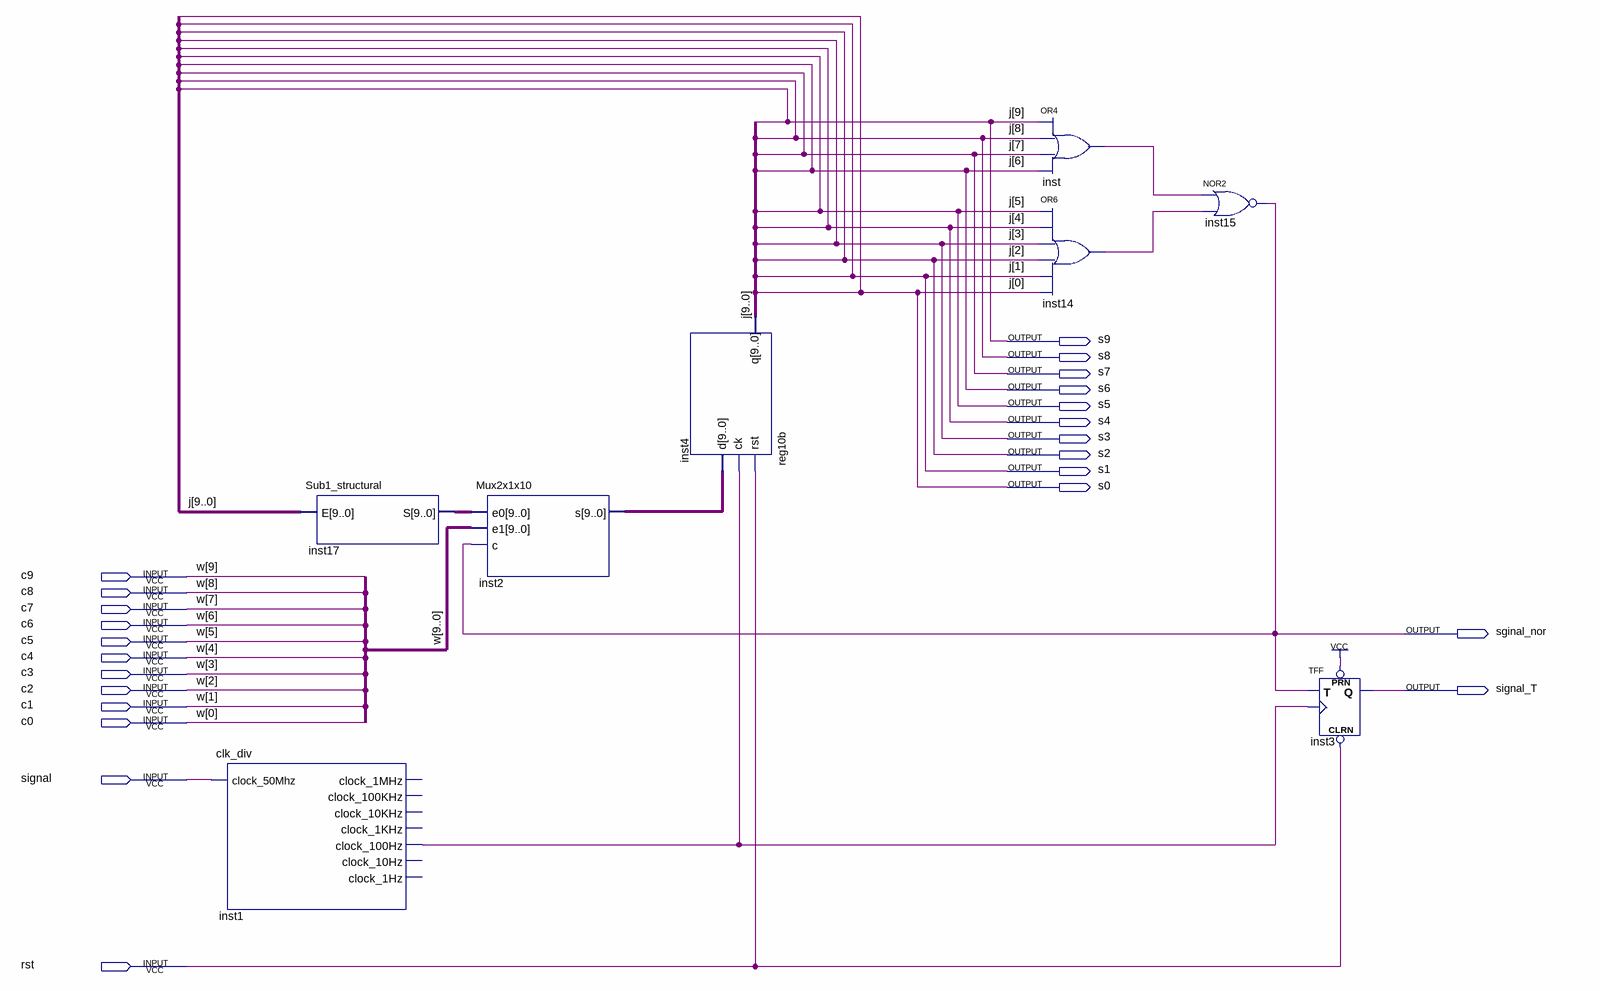
[diagram p0: schematic sheet]
// Quartus schematic exercicio01.bdf as structural Verilog: 8 symbols, 24 pins
module exercicio01 (
  input  c9,
  input  c8,
  input  c7,
  input  c6,
  input  c5,
  input  c4,
  input  c3,
  input  c2,
  input  c1,
  input  c0,
  input  signal,
  input  rst,
  output s9,
  output s8,
  output s7,
  output s6,
  output s5,
  output s4,
  output s3,
  output s2,
  output s1,
  output s0,
  output sginal_nor,
  output signal_T
);

  wire inst1_clock_100hz, inst14_out, inst_out;
  wire [9:0] inst2_s, inst17_s;

  clk_div inst1 (
    .clock_50Mhz(signal), .clock_100Hz(inst1_clock_100hz));  // open: clock_1MHz, clock_100KHz, clock_10KHz, clock_1KHz, clock_10Hz, clock_1Hz
  Sub1_structural inst17 (.E({s9, s8, s7, s6, s5, s4, s3, s2, s1, s0}), .S(inst17_s));
  Mux2x1x10 inst2 (.e0(inst17_s), .e1({c9, c8, c7, c6, c5, c4, c3, c2, c1, c0}), .c(sginal_nor), .s(inst2_s));
  reg10b inst4 (.rst(rst), .ck(inst1_clock_100hz), .d(inst2_s), .q({s9, s8, s7, s6, s5, s4, s3, s2, s1, s0}));
  or inst (inst_out, s9, s8, s7, s6);
  or inst14 (inst14_out, s5, s4, s3, s2, s1, s0);
  nor inst15 (sginal_nor, inst_out, inst14_out);
  TFF inst3 (.PRN(1'b1), .CLRN(rst), .T(sginal_nor), .CLK(inst1_clock_100hz), .Q(signal_T));

  // Other names for the same wires on the sheet: j[9:0] = {s9, s8, s7, s6, s5, s4, s3, s2, s1, s0};
  //   w[9:0] = {c9, c8, c7, c6, c5, c4, c3, c2, c1, c0}
endmodule
